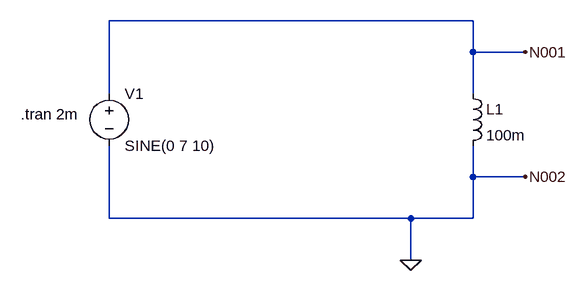
[diagram p0: schematic LAB02 - Task 2.asc]
LAB02 - Task 2.asc, the LTspice schematic file:
Version 4
SHEET 1 880 680
WIRE 640 192 80 192
WIRE 640 240 640 192
WIRE 720 240 640 240
WIRE 80 304 80 192
WIRE 640 304 640 240
WIRE 640 432 640 384
WIRE 720 432 640 432
WIRE 80 496 80 384
WIRE 544 496 80 496
WIRE 640 496 640 432
WIRE 640 496 544 496
WIRE 544 560 544 496
FLAG 544 560 0
FLAG 720 240 N001
FLAG 720 432 N002
SYMBOL voltage 80 288 R0
SYMATTR InstName V1
SYMATTR Value SINE(0 7 10)
SYMBOL ind 624 288 R0
SYMATTR InstName L1
SYMATTR Value 100m
TEXT -56 336 Left 2 !.tran 2m

The netlist it stands for:
* LAB02 - Task 2.asc
V1 N001 0 SINE(0 7 10)
L1 N001 0 100m
.tran 2m
.backanno
.end